# EAGLE schematic PCB_Sensors (EAGLE 9.6.2)
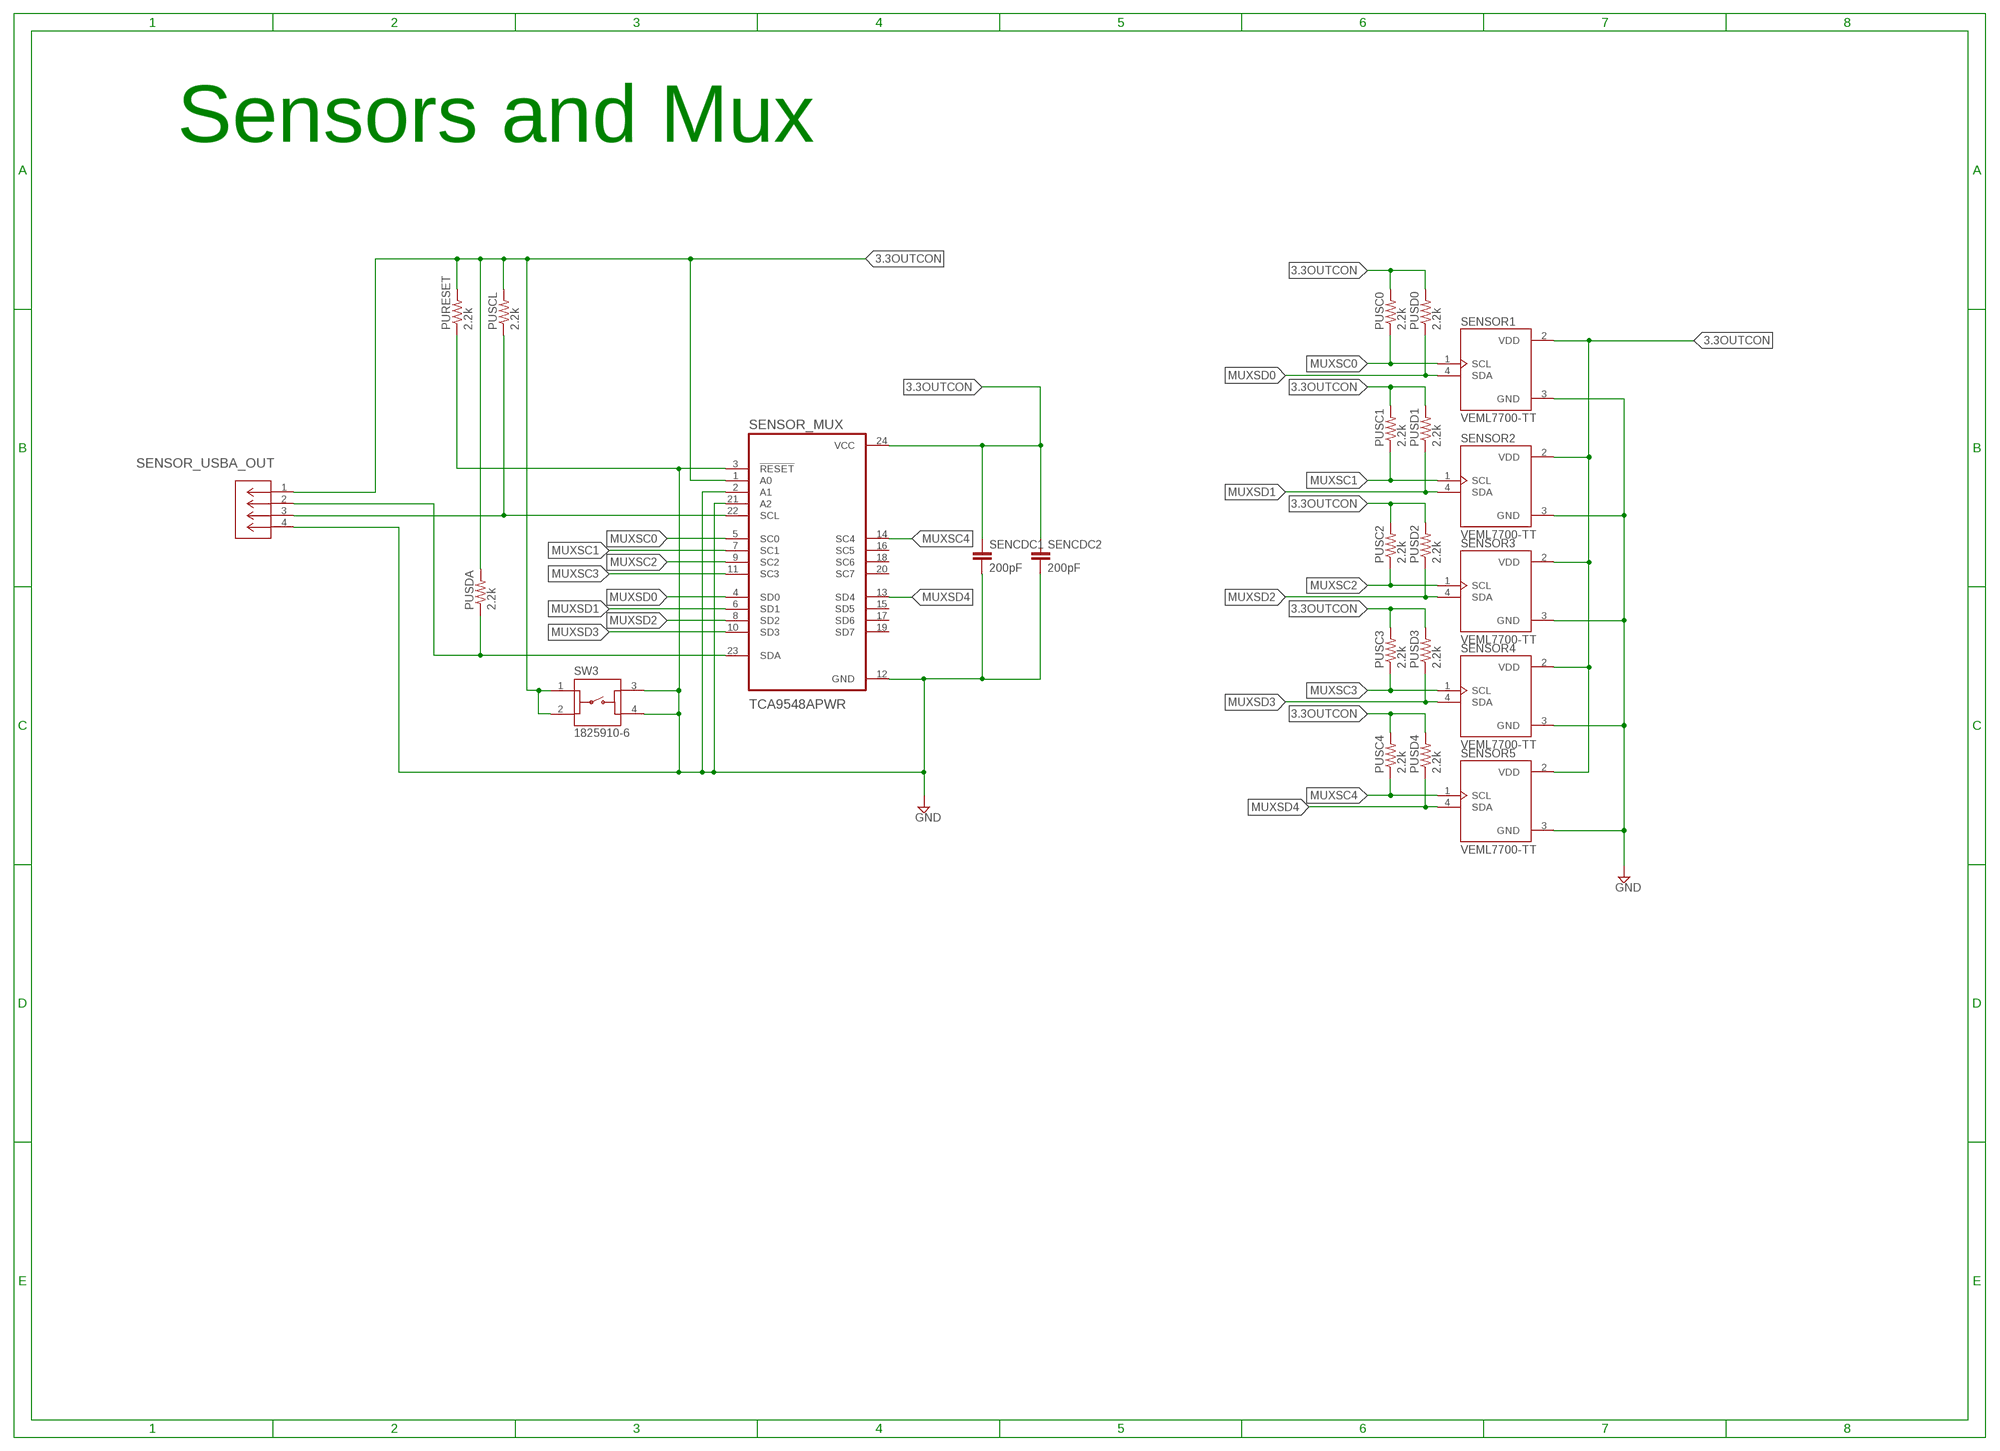
[diagram p0: schematic, sheet 1]

## Parts
PURESET  2.2k  R-US_M0805  [M0805]
PUSC0  2.2k  R-US_M0805  [M0805]
PUSC1  2.2k  R-US_M0805  [M0805]
PUSC2  2.2k  R-US_M0805  [M0805]
PUSC3  2.2k  R-US_M0805  [M0805]
PUSC4  2.2k  R-US_M0805  [M0805]
PUSCL  2.2k  R-US_M0805  [M0805]
PUSD0  2.2k  R-US_M0805  [M0805]
PUSD1  2.2k  R-US_M0805  [M0805]
PUSD2  2.2k  R-US_M0805  [M0805]
PUSD3  2.2k  R-US_M0805  [M0805]
PUSD4  2.2k  R-US_M0805  [M0805]
PUSDA  2.2k  R-US_M0805  [M0805]
SENCDC1  200pF  C-EUC0805  [C0805]
SENCDC2  200pF  C-EUC0805  [C0805]
SENSOR1  VEML7700-TT  [XDCR_VEML7700-TT]
SENSOR2  VEML7700-TT  [XDCR_VEML7700-TT]
SENSOR3  VEML7700-TT  [XDCR_VEML7700-TT]
SENSOR4  VEML7700-TT  [XDCR_VEML7700-TT]
SENSOR5  VEML7700-TT  [XDCR_VEML7700-TT]
SENSOR_MUX  TCA9548APWR  [SOP65P640X120-24N]
SENSOR_USBA_OUT  USB-AP-S-RA-SMT  [CONN_USB-AP-S-RA-SMT_ADM]
SW3  1825910-6  [SW_1825910-6-4]

## Nets
3.3OUTCON: PURESET.2 PUSC0.2 PUSC1.2 PUSC2.2 PUSC3.2 PUSC4.2 PUSCL.2 PUSD0.2 PUSD1.2 PUSD2.2 PUSD3.2 PUSD4.2 PUSDA.2 SENCDC1.1 SENCDC2.1 SENSOR1.2(VDD) SENSOR2.2(VDD) SENSOR3.2(VDD) SENSOR4.2(VDD) SENSOR5.2(VDD) SENSOR_MUX.1(A0) SENSOR_MUX.24(VCC) SENSOR_USBA_OUT.1 SW3.1 SW3.2
GND: PURESET.1 SENCDC1.2 SENCDC2.2 SENSOR1.3(GND) SENSOR2.3(GND) SENSOR3.3(GND) SENSOR4.3(GND) SENSOR5.3(GND) SENSOR_MUX.2(A1) SENSOR_MUX.3(!RESET) SENSOR_MUX.12(GND) SENSOR_MUX.21(A2) SENSOR_USBA_OUT.4 SW3.3 SW3.4
MCUI2CSCL: PUSCL.1 SENSOR_MUX.22(SCL) SENSOR_USBA_OUT.3
MCUI2CSDA: PUSDA.1 SENSOR_MUX.23(SDA) SENSOR_USBA_OUT.2
MUXSC0: PUSC0.1 SENSOR1.1(SCL) SENSOR_MUX.5(SC0)
MUXSC1: PUSC1.1 SENSOR2.1(SCL) SENSOR_MUX.7(SC1)
MUXSC2: PUSC2.1 SENSOR3.1(SCL) SENSOR_MUX.9(SC2)
MUXSC3: PUSC3.1 SENSOR4.1(SCL) SENSOR_MUX.11(SC3)
MUXSC4: PUSC4.1 SENSOR5.1(SCL) SENSOR_MUX.14(SC4)
MUXSD0: PUSD0.1 SENSOR1.4(SDA) SENSOR_MUX.4(SD0)
MUXSD1: PUSD1.1 SENSOR2.4(SDA) SENSOR_MUX.6(SD1)
MUXSD2: PUSD2.1 SENSOR3.4(SDA) SENSOR_MUX.8(SD2)
MUXSD3: PUSD3.1 SENSOR4.4(SDA) SENSOR_MUX.10(SD3)
MUXSD4: PUSD4.1 SENSOR5.4(SDA) SENSOR_MUX.13(SD4)
Unconnected: SENSOR_MUX.15(SD5) SENSOR_MUX.16(SC5) SENSOR_MUX.17(SD6) SENSOR_MUX.18(SC6) SENSOR_MUX.19(SD7) SENSOR_MUX.20(SC7)

## Notes on the sheet
- Sensors and Mux

## Library data of the parts
PURESET PUSC0 PUSC1-PUSC4 PUSCL PUSD0 PUSD1-PUSD4 PUSDA = rcl:R-US_: RESISTOR, American symbol; SPICEPREFIX: R
SENCDC1 SENCDC2 = rcl:C-EU: CAPACITOR, European symbol; SPICEPREFIX: C
SENSOR1-SENSOR5 = VEML7700-TT:VEML7700-TT: Check availability <https://pricing.snapeda.com/parts/VEML7700-TT/Vishay%20Semiconductor/view-part?ref=eda>; AVAILABILITY: In Stock; CHECK_PRICES: https://www.snapeda.com/parts/VEML7700-TT/Vishay+Semiconductor+Opto+Division/view-part/?ref=eda; DESCRIPTION: Optical Sensor Ambient - I²C 4-SMD, J-Lead; MF: Vishay Semiconductor; MP: VEML7700-TT; PACKAGE: SMD-4 Vishay Semiconductor; PRICE: None; PURCHASE-URL: https://www.snapeda.com/api/url_track_click_mouser/?unipart_id=534245&manufacturer=Vishay Semiconductor&part_name=VEML7700-TT&search_term=veml7700; SNAPEDA_LINK: https://www.snapeda.com/parts/VEML7700-TT/Vishay+Semiconductor+Opto+Division/view-part/?ref=snap
SENSOR_MUX = TCA9548APWR:TCA9548APWR: Check availability <https://pricing.snapeda.com/parts/TCA9548APWR/Texas%20Instruments/view-part?ref=eda>; AVAILABILITY: In Stock; CHECK_PRICES: https://www.snapeda.com/parts/TCA9548APWR/Texas+Instruments/view-part/?ref=eda; DESCRIPTION: 8-channel 1.65- to 5.5-V I2C/SMBus switch with reset & voltage translation; MF: Texas Instruments; MP: TCA9548APWR; PACKAGE: TSSOP-24 Texas Instruments; PRICE: None; PURCHASE-URL: https://www.snapeda.com/api/url_track_click_mouser/?unipart_id=280817&manufacturer=Texas Instruments&part_name=TCA9548APWR&search_term=tca9548a; SNAPEDA_LINK: https://www.snapeda.com/parts/TCA9548APWR/Texas+Instruments/view-part/?ref=snap
SENSOR_USBA_OUT = USB-AP-S-RA-SMT:USB-AP-S-RA-SMT; COPYRIGHT: Copyright (C) 2023 Ultra Librarian. All rights reserved.; MANUFACTURER_PART_NUMBER: USB-AP-S-RA-SMT; MFR_NAME: ADAM TECHNOLOGIES INC
SW3 = 1825910-6:1825910-6: Switch Tactile OFF (ON) SPST Round Button PC Pins 0.05A 24VDC 100000Cycles 1.57N Thru-Hole Loose Check availability <https://pricing.snapeda.com/parts/1825910-6/TE%20Connectivity/view-part?ref=eda>; AVAILABILITY: In Stock; CHECK_PRICES: https://www.snapeda.com/parts/1825910-6/TE+Connectivity+ALCOSWITCH+Switches/view-part/?ref=eda; COMMENT: 1825910-6; DESCRIPTION: Switch Push Button OFF (ON) SPST Round Button 0.05A 24VDC Momentary Contact PC Pins Thru-Hole; MF: TE Connectivity; MP: 1825910-6; PACKAGE: None; PRICE: None; PURCHASE-URL: https://www.snapeda.com/api/url_track_click_mouser/?unipart_id=226996&manufacturer=TE Connectivity&part_name=1825910-6&search_term=1825910-6; SNAPEDA_LINK: https://www.snapeda.com/parts/1825910-6/TE+Connectivity+ALCOSWITCH+Switches/view-part/?ref=snap